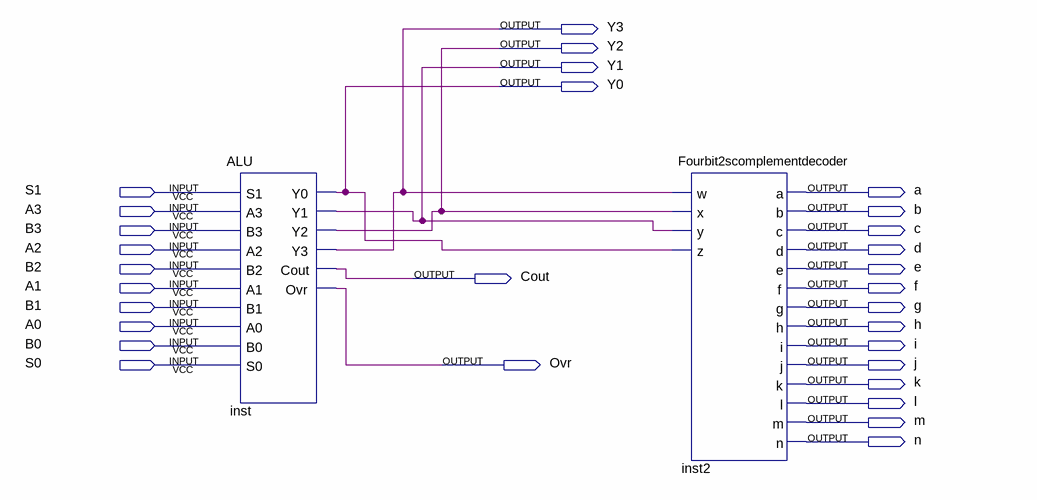
[diagram p0: schematic sheet]
// Quartus schematic ALUHex.bdf as structural Verilog: 2 symbols, 30 pins
module ALUHex (
  input  S1,
  input  A3,
  input  B3,
  input  A2,
  input  B2,
  input  A1,
  input  B1,
  input  A0,
  input  B0,
  input  S0,
  output Y3,
  output Y2,
  output Y1,
  output Y0,
  output a,
  output b,
  output c,
  output d,
  output e,
  output Cout,
  output f,
  output g,
  output h,
  output i,
  output Ovr,
  output j,
  output k,
  output l,
  output m,
  output n
);

  ALU inst (
    .S1(S1), .A3(A3), .B3(B3), .A2(A2), .B2(B2), .A1(A1), .B1(B1), .A0(A0), .B0(B0), .S0(S0), .Y0(Y0),
    .Y1(Y1), .Y2(Y2), .Y3(Y3), .Cout(Cout), .Ovr(Ovr));
  Fourbit2scomplementdecoder inst2 (
    .w(Y3), .x(Y2), .y(Y1), .z(Y0), .a(a), .b(b), .c(c), .d(d), .e(e), .f(f), .g(g), .h(h), .i(i), .j(j),
    .k(k), .l(l), .m(m), .n(n));
endmodule
